# Altium schematic sheet btn7960_board.SchDoc
size A2; PageSetup: Record=PageOptions|CenterHorizontal=True|CenterVertical=True|PrintScale=1.00|XCorrection=1.00|YCorrection=1.00|PrintKind=1|BorderSize=5000000|LeftOffset=0|BottomOffset=0|Orientation=2|PaperLength=1000|PaperWidth=1000|Scale=100|PaperSource=7|PrintQuality=-3|MediaType=1|DitherType=10|PrintScaleMode=1|PaperKind=A3|PaperIndex=8
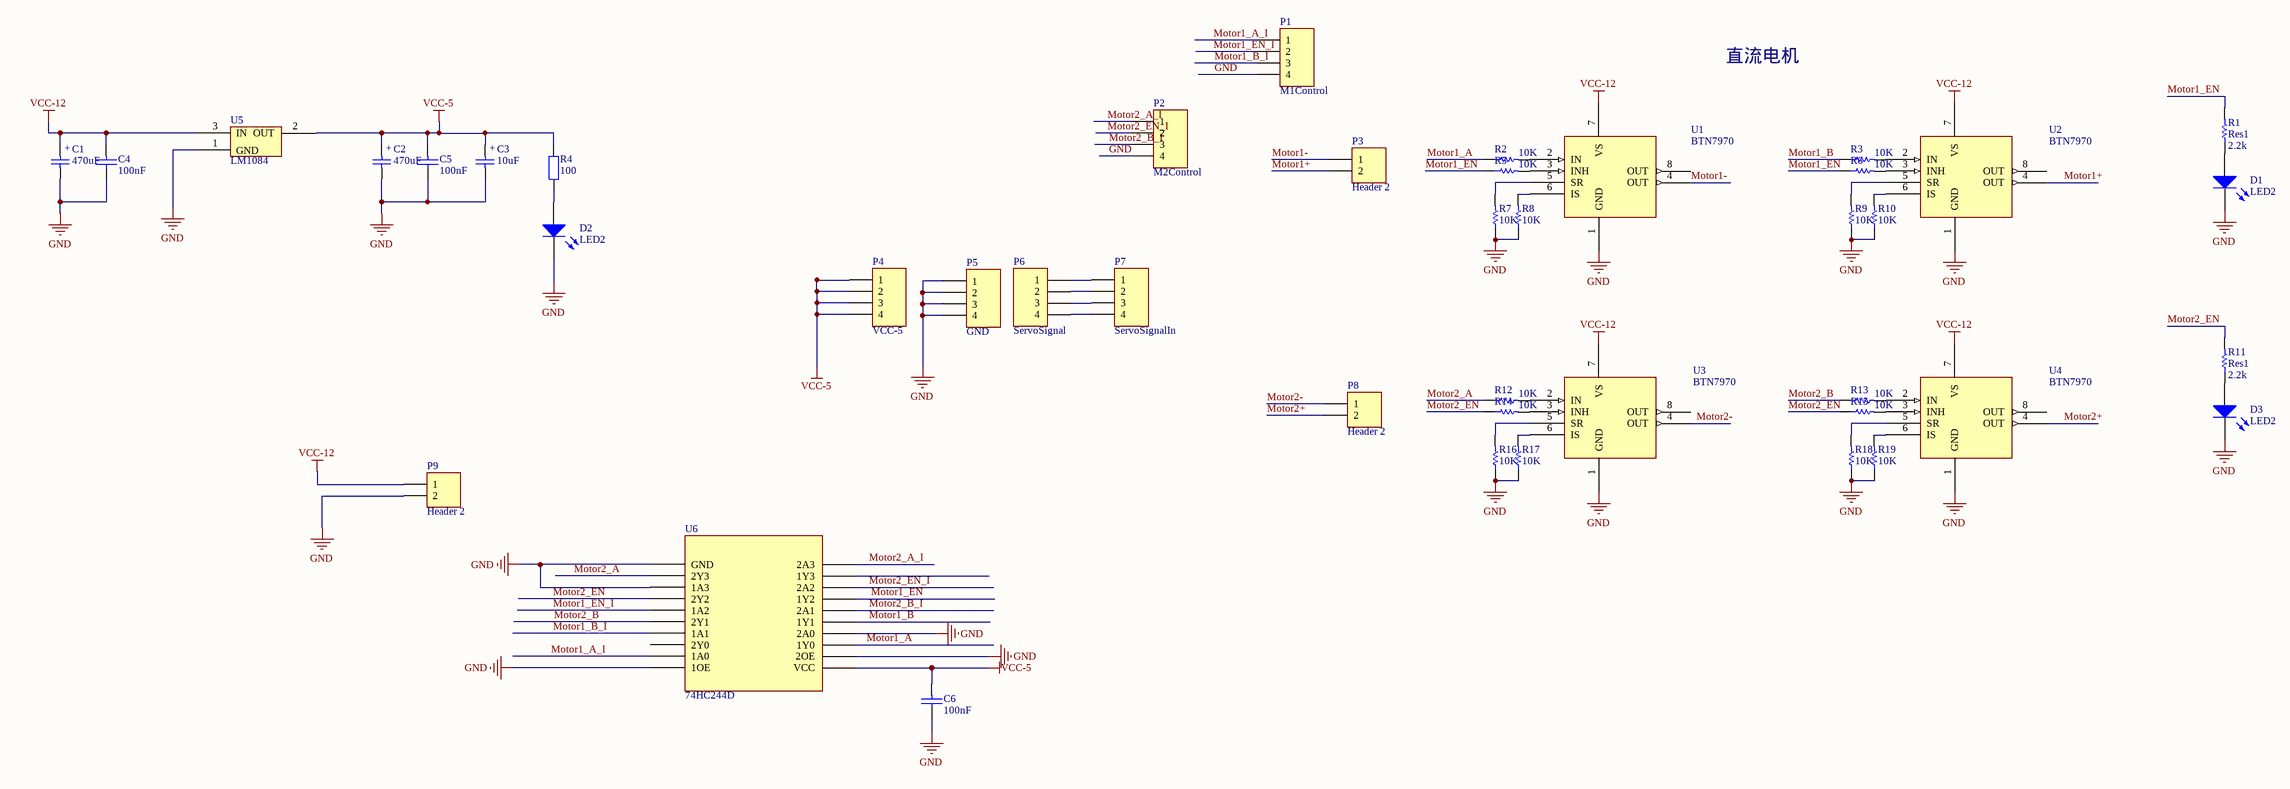
[diagram p0: btn7960_board.SchDoc]

## Parts
C1  value 470uF  [CAP-7343]  (hidden comment: Cap)
C2  value 470uF  [CAP-7343]  (hidden comment: Cap)
C3  value 10uF  [CAP-7343]  (hidden comment: Cap)
C4  value 100nF  [CAP-0603]  (hidden comment: cap smd)
C5  value 100nF  [CAP-0603]  (hidden comment: cap smd)
C6  value 100nF  [CAP-0603]  (hidden comment: cap smd)
D1  LED2  [D2012[0805]]
D2  LED2  [D2012[0805]]
D3  LED2  [D2012[0805]]
P1  M1Control  [HDR1X4]
P2  M2Control  [HDR1X4]
P3  Header 2  [WJ500V-5.08-2P]
P4  VCC-5  [HDR1X4]
P5  GND  [HDR1X4]
P6  ServoSignal  [HDR1X4]
P7  ServoSignalIn  [HDR1X4]
P8  Header 2  [WJ500V-5.08-2P]
P9  Header 2  [WJ500V-5.08-2P]
R1  Res1  value 2.2k  [RES-0603]
R2  10K  [RES-0603]
R3  10K  [RES-0603]
R4  value 100  [RES-0603]  (hidden comment: RES1)
R5  10K  [RES-0603]
R6  10K  [RES-0603]
R7  10K  [RES-0603]
R8  10K  [RES-0603]
R9  10K  [RES-0603]
R10  10K  [RES-0603]
R11  Res1  value 2.2k  [RES-0603]
R12  10K  [RES-0603]
R13  10K  [RES-0603]
R14  10K  [RES-0603]
R15  10K  [RES-0603]
R16  10K  [RES-0603]
R17  10K  [RES-0603]
R18  10K  [RES-0603]
R19  10K  [RES-0603]
U1  BTN7970  [BTN7970]
U2  BTN7970  [BTN7970]
U3  BTN7970  [BTN7970]
U4  BTN7970  [BTN7970]
U5  LM1084  [LC-TO-220(TO-220-3)]
U6  74HC244D  [LC-SOIC-20_300mil]

## Nets
GND: C1.2(-) C2.2(-) C3.2(-) C4.2 C5.2 C6.2 D1.2(K) D2.2(K) D3.2(K) P1.4 P2.4 P5.1 P5.2 P5.3 P5.4 P9.2 R7.1 R8.1 R9.1 R10.1 R16.1 R17.1 R18.1 R19.1 U1.1(GND) U2.1(GND) U3.1(GND) U4.1(GND) U5.1(GND) U6.1(1OE) U6.8(1A3) U6.10(GND) U6.17(2A0) U6.19(2OE)
VCC-5: C2.1(+) C3.1(+) C5.1 C6.1 P4.1 P4.2 P4.3 P4.4 R4.2 U5.2(OUT) U6.20(VCC)
VCC-12: C1.1(+) C4.1 P9.1 U1.7(VS) U2.7(VS) U3.7(VS) U4.7(VS) U5.3(IN)
Motor1+: P3.2 U2.4(OUT)
Motor1-: P3.1 U1.4(OUT)
Motor1_A: R2.1 U6.18(1Y0)
Motor1_A_I: P1.1 U6.2(1A0)
Motor1_B: R3.1 U6.16(1Y1)
Motor1_B_I: P1.3 U6.4(1A1)
Motor1_EN: R1.2 R5.1 R6.1 U6.14(1Y2)
Motor1_EN_I: P1.2 U6.6(1A2)
Motor2+: P8.2 U4.4(OUT)
Motor2-: P8.1 U3.4(OUT)
Motor2_A: R12.1 U6.9(2Y3)
Motor2_A_I: P2.1 U6.11(2A3)
Motor2_B: R13.1 U6.5(2Y1)
Motor2_B_I: P2.3 U6.15(2A1)
Motor2_EN: R11.2 R14.1 R15.1 U6.7(2Y2)
Motor2_EN_I: P2.2 U6.13(2A2)
NetD1_1: D1.1(A) R1.1
NetD2_1: D2.1(A) R4.1
NetD3_1: D3.1(A) R11.1
NetP6_1: P6.1 P7.1
NetP6_2: P6.2 P7.2
NetP6_3: P6.3 P7.3
NetP6_4: P6.4 P7.4
NetR2_2: R2.2 U1.2(IN)
NetR3_2: R3.2 U2.2(IN)
NetR5_2: R5.2 U1.3(INH)
NetR6_2: R6.2 U2.3(INH)
NetR7_2: R7.2 U1.5(SR)
NetR8_2: R8.2 U1.6(IS)
NetR9_2: R9.2 U2.5(SR)
NetR10_2: R10.2 U2.6(IS)
NetR12_2: R12.2 U3.2(IN)
NetR13_2: R13.2 U4.2(IN)
NetR14_2: R14.2 U3.3(INH)
NetR15_2: R15.2 U4.3(INH)
NetR16_2: R16.2 U3.5(SR)
NetR17_2: R17.2 U3.6(IS)
NetR18_2: R18.2 U4.5(SR)
NetR19_2: R19.2 U4.6(IS)

Not connected (* = marked no-connect by the designer): U1 8(OUT); U2 8(OUT); U3 8(OUT); U4 8(OUT); U6 3(2Y0) 12(1Y3)

## Notes on the sheet
- 直流电机

## Library data of the parts
C1-C3 = Cap Pol S: 贴片极性电容
C4-C6 = CAP: 贴片无极性电容
D1-D3 = LED2: Typical RED, GREEN, YELLOW, AMBER GaAs LED; Published: 8-Jun-2000; LatestRevisionDate: 17-Jul-2002; LatestRevisionNote: Re-released for DXP Platform.; PackageReference: 3.2X1.6X1.1; Publisher: Altium Limited
  D1 D3: PackageVersion: Feb-2002; PackageDescription: SM LED; 2 Flat Leads
  D2: PackageDocument: Feb-2002
P1 P2 P4-P7 = Header 4: Header, 4-Pin; LatestRevisionDate: 17-Jul-2002; LatestRevisionNote: Re-released for DXP Platform.; Publisher: Altium Limited
P3 P8 P9 = Header 2: Header, 2-Pin; LatestRevisionDate: 17-Jul-2002; LatestRevisionNote: Re-released for DXP Platform.; Publisher: Altium Limited
R1 R11 = Res1: Resistor; Published: 8-Jun-2000; LatestRevisionDate: 17-Jul-2002; LatestRevisionNote: Re-released for DXP Platform.; PackageReference: AXIAL-0.3; Publisher: Altium Limited; PackageDescription: Axial Device, Thru-Hole; 2 Leads; 0.3 in Pin Spacing
R2 R3 R5-R10 R12-R19 = res1: Resistor; Revision: July-2002: Re-released for DXP Platform.; Value: 10K
U1-U4 = BTN7970: pin to pad: 8>4